# Altium schematic sheet Sheet01.SchDoc
size A4
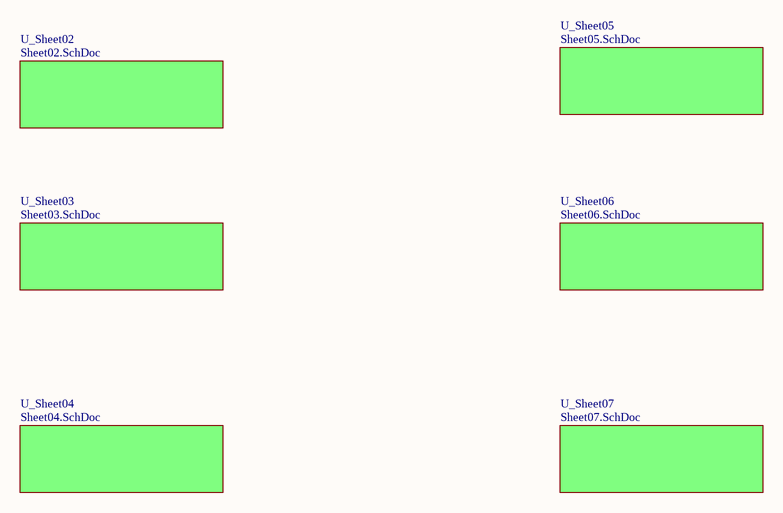
[diagram p0: Sheet01.SchDoc]

## Sub-sheets
U_Sheet02 = Sheet02.SchDoc: no entries
U_Sheet03 = Sheet03.SchDoc: no entries
U_Sheet04 = Sheet04.SchDoc: no entries
U_Sheet05 = Sheet05.SchDoc: no entries
U_Sheet06 = Sheet06.SchDoc: no entries
U_Sheet07 = Sheet07.SchDoc: no entries